# Altium schematic sheet dcdc.schdoc
size 209 x 297 mm; PageSetup: Record=PageOptions|CenterHorizontal=False|CenterVertical=False|PrintScale=0.95|XCorrection=0.00|YCorrection=0.00|PrintKind=1|BorderSize=5000000|LeftOffset=0|BottomOffset=0|Orientation=1|PaperLength=1000|PaperWidth=1000|Scale=100|PaperSource=15|PrintQuality=600|MediaType=1|DitherType=10|PaperKind=A4|PrintScaleMode=1
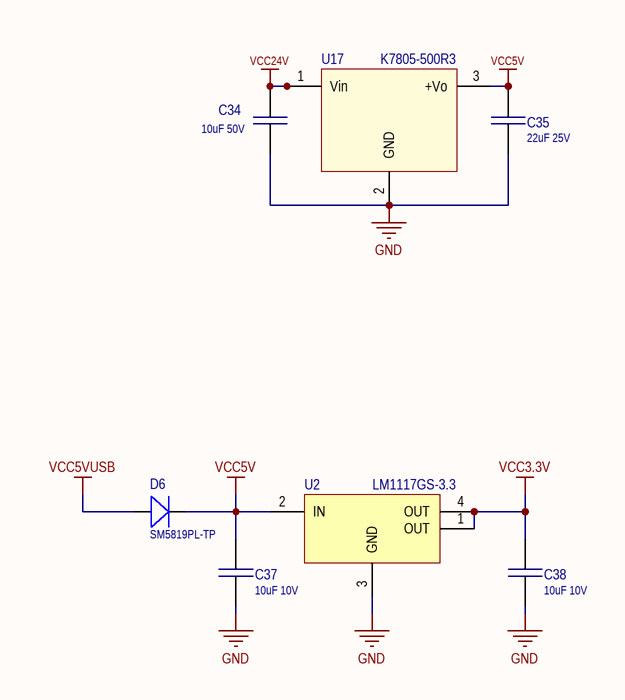
[diagram p0: dcdc.schdoc]

## Parts
C34  10uF 50V  [C_1206]
C35  22uF 25V  [C_1206]
C37  10uF 10V  [C_0805]
C38  10uF 10V  [C_0805]
D6  SM5819PL-TP  [SOD-123]
U2  LM1117GS-3.3  [SOT 223]
U17  K7805-500R3  [K7805500R3]

## Nets
GND: C34.2 C35.1 C37.1 C38.1 U2.3(GND) U17.2(GND)
VCC3.3V: C38.2 U2.1(OUT) U2.4(OUT)
VCC5V: C35.2 C37.2 D6.2(K) U2.2(IN) U17.3(+Vo)
VCC5VUSB: D6.1(A)
VCC24V: C34.1 U17.1(Vin)

## Library data of the parts
C34 = C1206: Capacitor; Part: CC1206KKX5R9BB106; Alternative Part: CL31A106KBHNNNE; Value: 10uF 50V; JLCPCB Part: C100122
C35 = C1206: Capacitor; Part: CC1206KKX5R8BB226; Alternative Part: CL31A226KAHNNNE; Value: 22uF 25V; JLCPCB Part: C2178233
C37 C38 = C0805: Capacitor; Part: CC0805KKX5R6BB106; Value: 10uF 10V; Parameter 2: *; JLCPCB Part: C89832
D6 = D_SOD123: Diode; Part: SM5819PL-TP; JLCPCB Part: C19992592
U2 = LDO 3.3v: Part: LM1117GS-3.3; JLCPCB Part: C411821
U17 = K78xx-500R3: Non-isolated dc-dc; Part: K7805-500R3; JLCPCB Part: C19188491